# EAGLE design Tauchlampe (EAGLE 6.5.0)
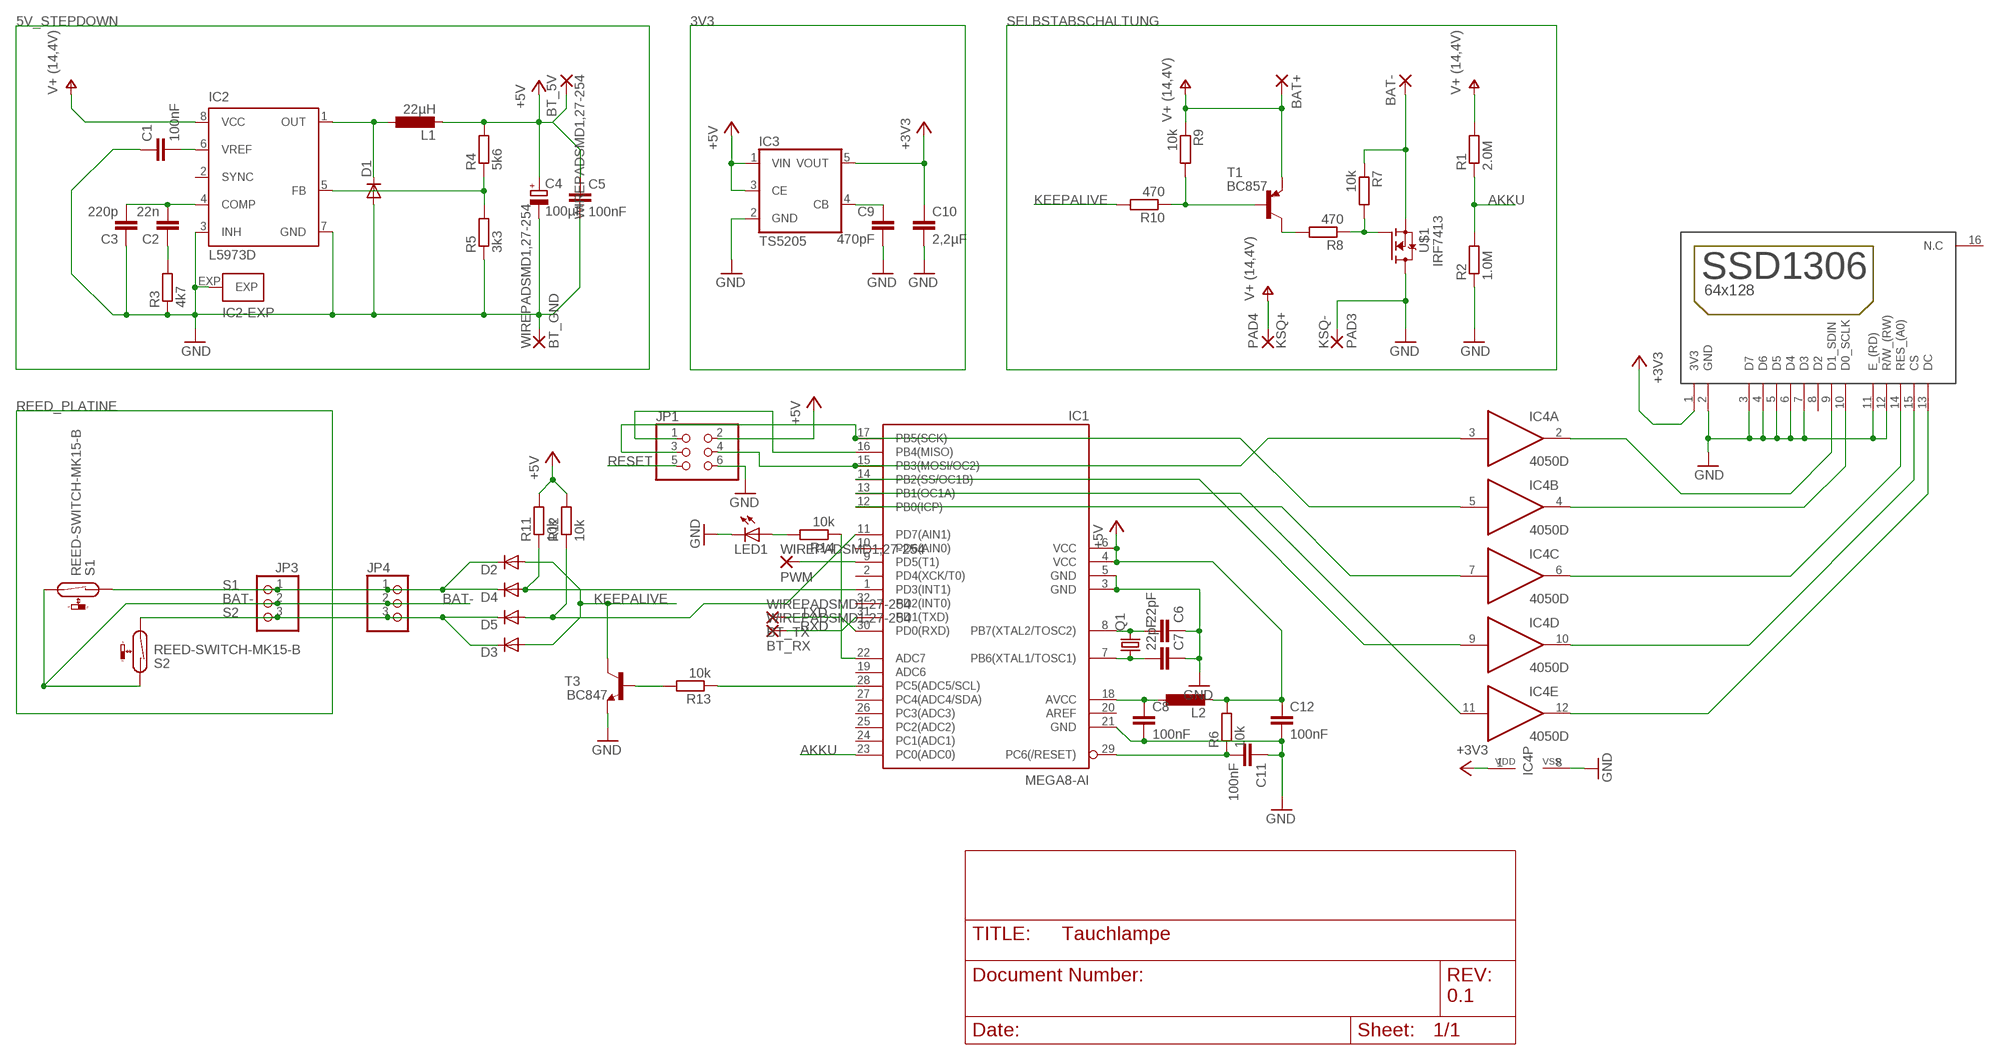
[diagram p0: schematic, sheet 1]

## Parts
BAT+  WIREPAD3,81/1,1  [3,81/1,1]
BAT-  WIREPAD3,81/1,1  [3,81/1,1]
BT_5V  WIREPADSMD1,27-254  [SMD1,27-2,54]
BT_GND  WIREPADSMD1,27-254  [SMD1,27-2,54]
BT_RX  WIREPADSMD1,27-254  [SMD1,27-2,54]
BT_TX  WIREPADSMD1,27-254  [SMD1,27-2,54]
C1  100nF  C-EUC0603K  [C0603K]
C2  22n  C-EUC0603K  [C0603K]
C3  220p  C-EUC0603K  [C0603K]
C4  100µF  CPOL-EU153CLV-0505  [153CLV-0505]
C5  100nF  C-EUC1206  [C1206]
C6  22pF  C-EUC1206  [C1206]
C7  22pF  C-EUC1206  [C1206]
C8  100nF  C-EUC0603K  [C0603K]
C9  470pF  C-EUC0603  [C0603]
C10  2,2µF  C-EUC0603  [C0603]
C11  100nF  C-EUC0603K  [C0603K]
C12  100nF  C-EUC0603K  [C0603K]
D1  DIODE-SMB  [SMB]
D2  DIODE-SOD323-W  [SOD323-W]
D3  DIODE-SOD323-W  [SOD323-W]
D4  DIODE-SOD323-W  [SOD323-W]
D5  DIODE-SOD323-W  [SOD323-W]
IC1  MEGA8-AI  [TQFP32-08]
IC2  L5973D  [HSOP8]
IC3  TS5205  [SOT25]
IC4  4050D  [SO16]
JP1  PINHD-2X3  [2X03]
JP3  PINHD-1X03_2.54  [1X03]
JP4  PINHD-1X03_2.54  [1X03]
L1  22µH  L-EUPISG  [PISG]
L2  L-EUL2012C  [L2012C]
LED1  LEDCHIP-LED0805  [CHIP-LED0805]
PAD3  KSQ-  WIREPAD3,81/1,1  [3,81/1,1]
PAD4  KSQ+  WIREPAD3,81/1,1  [3,81/1,1]
PWM  WIREPADSMD1,27-254  [SMD1,27-2,54]
Q1  CRYSTALHC49UP  [HC49UP]
R1  2.0M  R-EU_M1206  [M1206]
R2  1.0M  R-EU_M1206  [M1206]
R3  4k7  R-EU_R0603  [R0603]
R4  5k6  R-EU_R0603  [R0603]
R5  3k3  R-EU_R0603  [R0603]
R6  10k  R-EU_R1206  [R1206]
R7  10k  R-EU_M0805  [M0805]
R8  470  R-EU_M0805  [M0805]
R9  10k  R-EU_M0805  [M0805]
R10  470  R-EU_M0805  [M0805]
R11  10k  R-EU_M1206  [M1206]
R12  10k  R-EU_M1206  [M1206]
R13  10k  R-EU_M1206  [M1206]
R14  10k  R-EU_M0805  [M0805]
S1  REED-SWITCH-MK15-B  [MK15]
S2  REED-SWITCH-MK15-B  [MK15]
T1  BC857  BC857A-PNP-SOT23-BEC  [SOT23-BEC]
T3  BC847  [SOT23]
U$1  IRF7413  [SO-8]
U$2  SDD1306  [2X08]

## Nets
+3V3: C10.1 IC3.5(VOUT) IC4.1(P:VDD) U$2.1(3V3)
+5V: BT_5V.1(P) C4.+ C5.1 C12.1 IC1.4(VCC) IC1.6(VCC) IC3.1(VIN) IC3.3(CE) JP1.2 L1.2 L2.2 R4.2 R6.2 R11.2 R12.2
AKKU: IC1.23(PC0(ADC0)) R1.1 R2.2
BAT-: BAT-.1(P) JP3.2 JP4.2 R7.1 S1.2 S2.1 U$1.1(S) U$1.2(S) U$1.3(S)
CS_5V: IC1.14(PB2(SS/OC1B)) IC4.9(D:I)
D0_SCLK_5V: IC1.17(PB5(SCK)) IC4.5(B:I) JP1.3
D1_SDIN_5V: IC1.15(PB3(MOSI/OC2)) IC4.3(A:I) JP1.4
DC_5V: IC1.13(PB1(OC1A)) IC4.11(E:I)
GND: BT_GND.1(P) C1.1 C3.1 C4.- C5.2 C6.1 C7.1 C8.2 C9.2 C10.2 C11.1 C12.2 D1.A IC1.3(GND) IC1.5(GND) IC1.21(GND) IC2.3(INH) IC2.7(GND) IC2.EXP IC3.2(GND) IC4.8(P:VSS) JP1.6 LED1.C PAD3.1(P) R2.1 R3.1 R5.1 T3.2(E) U$1.5(D) U$1.6(D) U$1.7(D) U$1.8(D) U$2.2(GND) U$2.3(D7) U$2.4(D6) U$2.5(D5) U$2.6(D4) U$2.7(D3) U$2.11(E_(RD)) U$2.12(R/W_(RW))
KEEPALIVE: D2.A D3.A R10.2 T3.3(C)
N$1: C1.2 IC2.6(VREF)
N$2: D4.A IC1.1(PD3(INT1)) R11.1
N$3: C2.2 C3.2 IC2.4(COMP)
N$4: C2.1 R3.2
N$5: D1.C IC2.1(OUT) L1.1
N$6: C6.2 IC1.8(PB7(XTAL2/TOSC2)) Q1.2
N$7: IC2.5(FB) R4.1 R5.2
N$8: C7.2 IC1.7(PB6(XTAL1/TOSC1)) Q1.1
N$9: R7.2 R8.1 U$1.4(G)
N$10: R9.2 R10.1 T1.B
N$11: R8.2 T1.C
N$12: D5.A IC1.11(PD7(AIN1)) R12.1
N$13: R13.2 T3.1(B)
N$16: IC1.16(PB4(MISO)) JP1.1
N$18: IC1.28(PC5(ADC5/SCL)) R13.1
N$19: C9.1 IC3.4(CB)
N$21: C8.1 IC1.18(AVCC) L2.1
N$22: IC4.2(A:O) U$2.9(D1_SDIN)
N$23: IC4.4(B:O) U$2.10(D0_SCLK)
N$24: IC4.6(C:O) U$2.14(RES_(A0))
N$25: IC4.10(D:O) U$2.15(CS)
N$26: IC4.12(E:O) U$2.13(DC)
N$27: IC1.9(PD5(T1)) PWM.1(P)
N$33: LED1.A R14.2
N$34: IC1.22(ADC7) R14.1
RES_5V: IC1.12(PB0(ICP)) IC4.7(C:I)
RESET: C11.2 IC1.29(PC6(/RESET)) JP1.5 R6.1
RXD: BT_RX.1(P) IC1.31(PD1(TXD))
S1: D2.C D4.C JP3.1 JP4.1 S1.1
S2: D3.C D5.C JP3.3 JP4.3 S2.2
TXD: BT_TX.1(P) IC1.30(PD0(RXD))
V+: BAT+.1(P) IC2.8(VCC) PAD4.1(P) R1.2 R9.1 T1.E ; supply symbol labelled V+ (14,4V)
Unconnected: IC1.2(PD4(XCK/T0)) IC1.10(PD6(AIN0)) IC1.19(ADC6) IC1.20(AREF) IC1.24(PC1(ADC1)) IC1.25(PC2(ADC2)) IC1.26(PC3(ADC3)) IC1.27(PC4(ADC4/SDA)) IC1.32(PD2(INT0)) IC2.2(SYNC) IC4.14(F:I) IC4.15(F:O) U$2.8(D2) U$2.16(N.C)

## Notes on the sheet
- 0.1

## Library data of the parts
BAT+ BAT- BT_5V BT_GND BT_RX BT_TX PAD3 PAD4 PWM = wirepad:WIREPAD: Wire PAD connect wire on PCB
C1-C3 C5-C12 = rcl:C-EU: CAPACITOR, European symbol
C4 = rcl:CPOL-EU: POLARIZED CAPACITOR, European symbol
D1-D5 = diode:DIODE-: DIODE
IC1 = atmel:MEGA8: MICROCONTROLLER 8 Kbytes FLASH, 1 kbytes SRAM, 512 bytes EEPROM, USART, 6-channel 10 bit ADC, 2-channel 8 bit ADC Pin compatible with Atmega48, ATMega88, ATMega168 Source: avr.lbr; MPN: ATMEGA8-16AU; OC_FARNELL: 9171371; OC_NEWARK: 73M8863
IC2 = st-microelectronics:L5973D: 2.5 A switch step down switching regulator Source: Data sheet <http://www.st.com/internet/com/TECHNICAL_RESOURCES/TECHNICAL_LITERATURE/DATASHEET/CD00002851.pdf>; MF: STMICROELECTRONICS; MPN: L5973D; OC_FARNELL: 1077145
IC3 = v-reg:TS5205: 150mA Low Noise LDO Voltage Regulator with Enable TSC [Taiwan Semiconductor Company, Ltd] Source: http://www.taiwansemi.com .. 5205_0409c.pdf
IC4 = 40xx:4050: Hex non-inverting BUFFER
JP1 = pinhead:PINHD-2X3: PIN HEADER
JP3 JP4 = pinhead-2:PINHD-1X03: PIN HEADER
L1 = inductor-fastron:L-EU
L2 = rcl:L-EU: INDUCTOR, European symbol
LED1 = led:LED: LED OSRAM: - CHIPLED LG R971, LG N971, LY N971, LG Q971, LY Q971, LO R971, LY R971 LH N974, LH R974 LS Q976, LO Q976, LY Q976 LO Q996 - Hyper CHIPLED LW Q18S LB Q993, LB Q99A, LB R99A - SideLED LS A670, LO A670, LY A670, LG A670, LP A670 LB A673, LV A673, LT A673, LW A673 LH A674 LY A675 LS A676, LA A676, LO A676, LY A676, LW A676 LS A679, LY A679, LG A679 - Hyper Micro SIDELED® LS Y876, LA Y876, LO Y876, LY Y876 LT Y87S - SmartLED LW L88C, LW L88S LB L89C, LB L89S, LG L890 LS L89K, LO L89K, LY L89K LS L896, LA L896, LO L896, LY L896 - TOPLED LS T670, LO T670, LY T670, LG T670, LP T670 LSG T670, LSP T670, LSY T670, LOP T670, LYG T670 LG T671, LOG T671, LSG T671 LB T673, LV T673, LT T673, LW T673 LH T674 LS T676, LA T676, LO T676, LY T676, LB T676, LH T676, LSB T676, LW T676 LB T67C, LV T67C, LT T67C, LS T67K, LO T67K, LY T67K, LW E67C LS E67B, LA E67B, LO E67B, LY E67B, LB E67C, LV E67C, LT E67C LW T67C LS T679, LY T679, LG T679 LS T770, LO T770, LY T770, LG T770, LP T770 LB T773, LV T773, LT T773, LW T773 LH T774 LS E675, LA E675, LY E675, LS T675 LS T776, LA T776, LO T776, LY T776, LB T776 LHGB T686 LT T68C, LB T68C - Hyper Mini TOPLED® LB M676 - Mini TOPLED Santana® LG M470 LS M47K, LO M47K, LY M47K Source: http://www.osram.convergy.de LUXEON: - LUMILED® LXK2-PW12-R00, LXK2-PW12-S00, LXK2-PW14-U00, LXK2-PW14-V00 LXK2-PM12-R00, LXK2-PM12-S00, LXK2-PM14-U00 LXK2-PE12-Q00, LXK2-PE12-R00, LXK2-PE12-S00, LXK2-PE14-T00, LXK2-PE14-U00 LXK2-PB12-K00, LXK2-PB12-L00, LXK2-PB12-M00, LXK2-PB14-N00, LXK2-PB14-P00, LXK2-PB14-Q00 LXK2-PR12-L00, LXK2-PR12-M00, LXK2-PR14-Q00, LXK2-PR14-R00 LXK2-PD12-Q00, LXK2-PD12-R00, LXK2-PD12-S00 LXK2-PH12-R00, LXK2-PH12-S00 LXK2-PL12-P00, LXK2-PL12-Q00, LXK2-PL12-R00 Source: www.luxeon.com KINGBRIGHT: KA-3528ASYC Source: www.kingbright.com
Q1 = crystal:CRYSTAL: CRYSTAL; OC_FARNELL: unknown; OC_NEWARK: unknown
R1-R14 = rcl:R-EU_: RESISTOR, European symbol
S1 S2 = switch-reed:REED-SWITCH-: Reed Sensor; MF: MEDER; MPN: MK15-B-2; OC_FARNELL: 1079484
T1 = transistor:*-PNP-: PNP Transistror
T3 = transistor:BC847: NPN TRANSISTOR
U$1 = 01_eigeneBauteile:IRF7413
U$2 = Display-SSD1306:SDD1306

## Net classes
0 default: width 0.406 mm

## Board
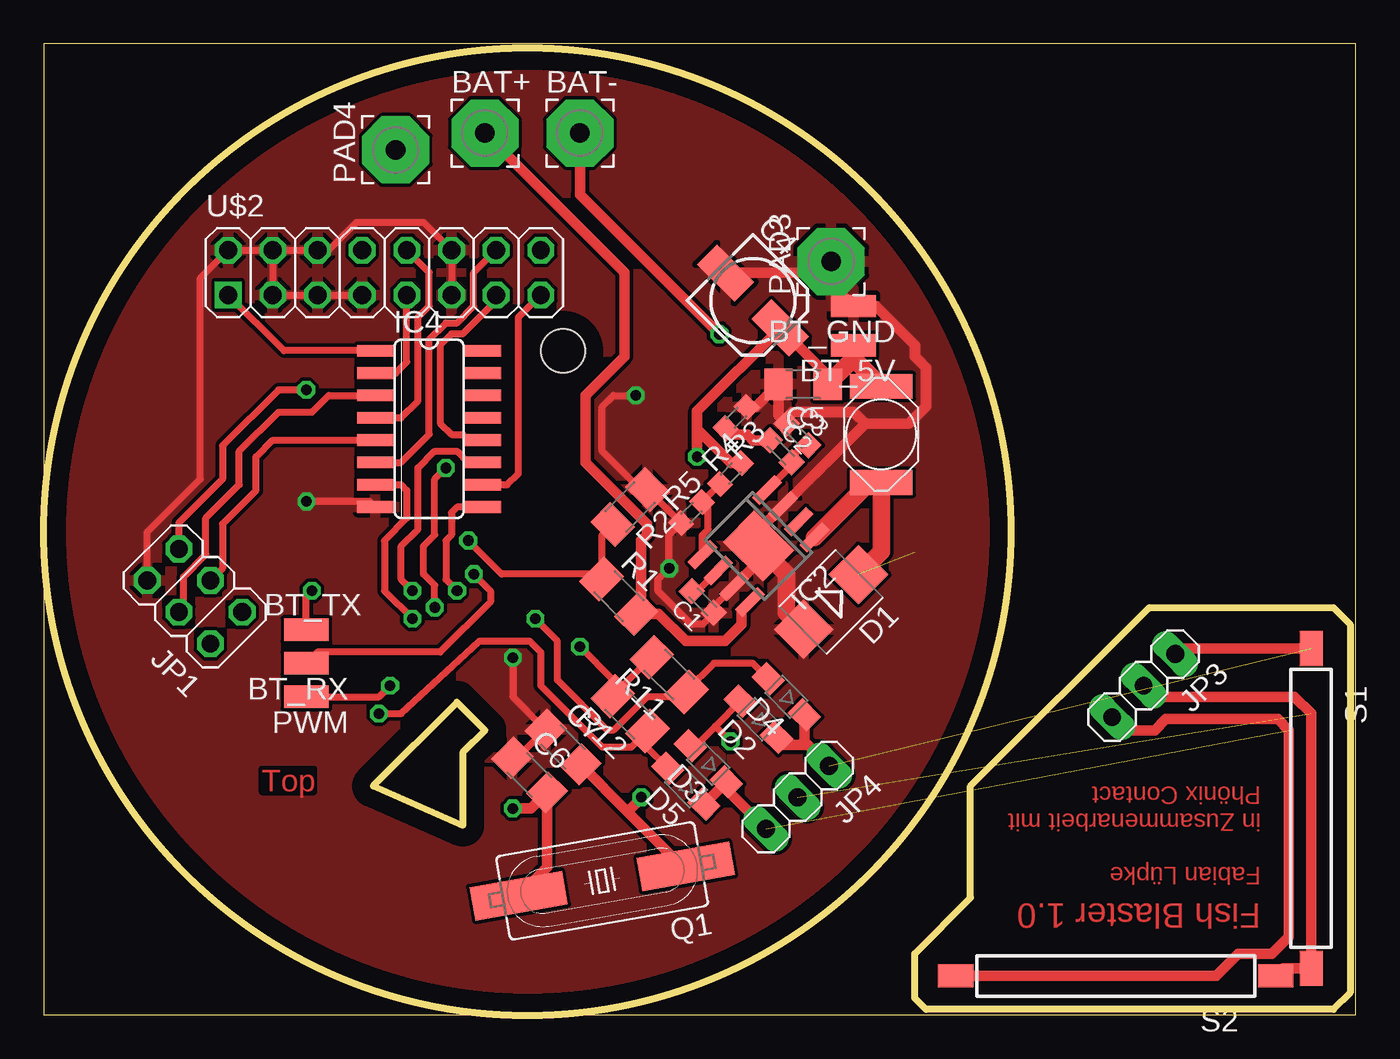
[diagram p1: board, top side]
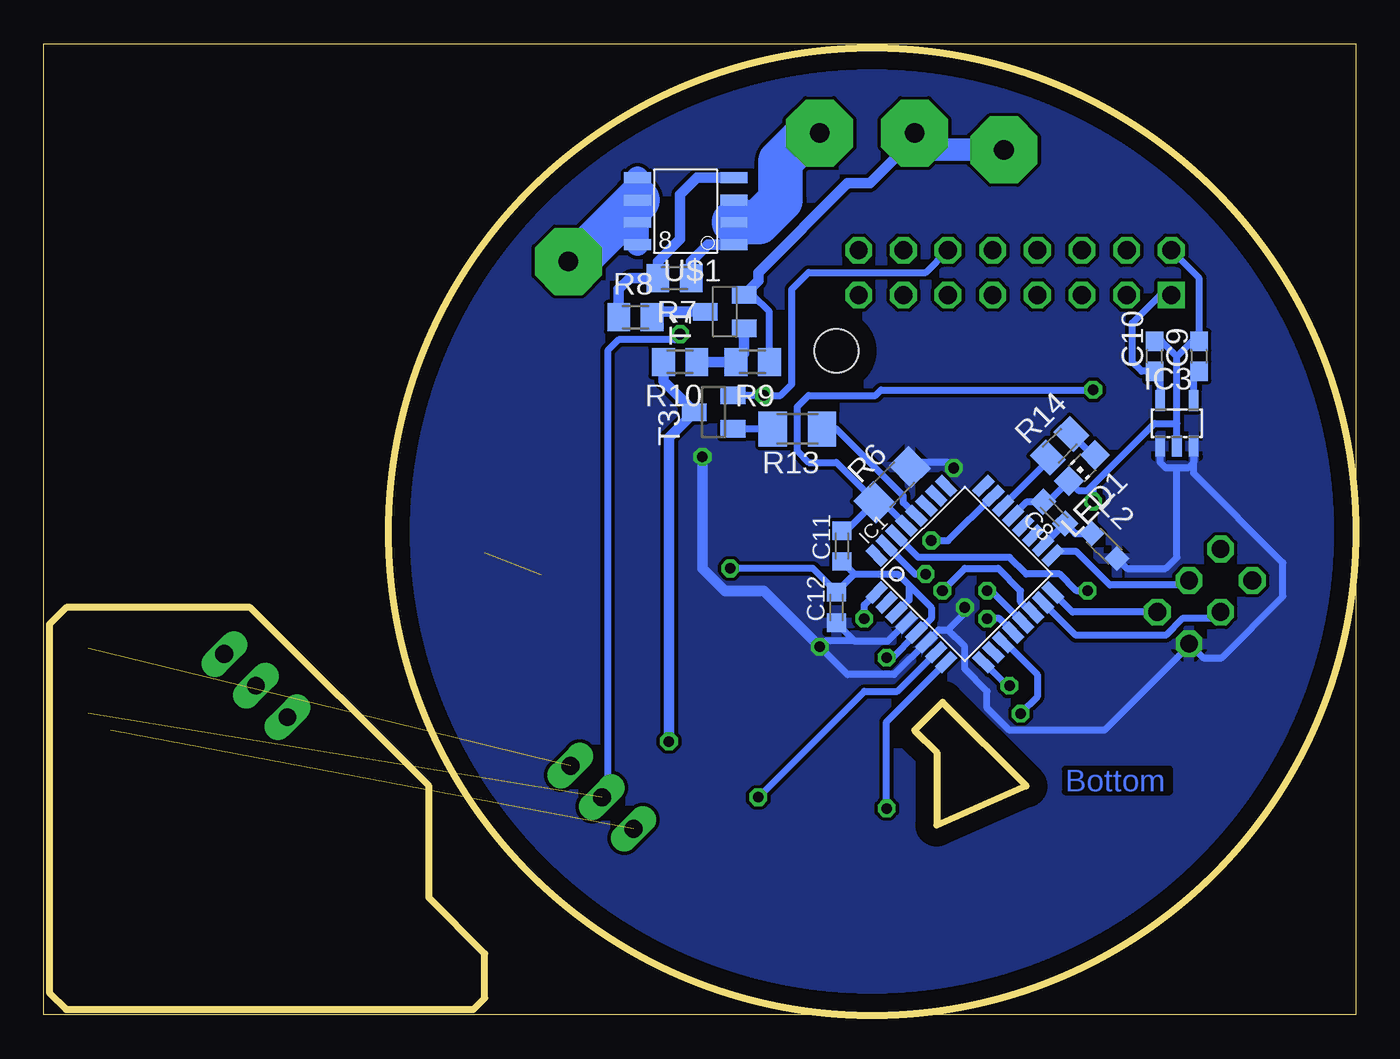
[diagram p2: board, bottom side, seen from below]

Size 74.6 x 55.23 mm. Coordinates in mm from the lower left corner, seen from the top.
Outline: 0,0 74.6,0 74.6,55.23 0,55.23 0,0
Outline: 23.5,17.78 25.08,16.19 23.81,14.92 23.81,10.79 18.73,13.02 23.5,17.78
Outline: 73.34,0.32 50.16,0.32 49.53,0.95 49.53,3.49 52.7,6.67 52.7,13.02 62.87,23.18 73.34,23.18 74.3,22.23 74.3,1.27 73.34,0.32
Outline: circle at 27.5,27.5 radius 27.5
Copper layers (1*16): Top 0.035mm / dielectric 1.5mm / Bottom 0.035mm
Design rules "default": minimum track width 10mil, minimum drill 24mil, track to track 8mil, track to pad 8mil, pad to pad 8mil, via to via 8mil, smd to smd 8mil, copper to edge 40mil, drill to drill 8mil, minimum pad ring 10mil, minimum via ring 8mil, stop-mask expansion 4mil, vias tented up to drill 0mil, thermal gap 10mil
Holes 2.5 mm at 29.53,37.78

### Footprints (pad centres in the part's own frame; a part is rotated, then mirrored left to right if it is on the bottom)
3,81/1,1 = drill 1.118 pad 3.81 octagon: 1 0,0
SMD1,27-2,54 = smd 1.27 x 2.54: 1 0,0
C0603K = smd 1.05 x 1.08: 1 -0.875,0; 2 0.875,0
153CLV-0505 = smd 3 x 1.6: + 2.2,0; - -2.2,0
C1206 = smd 1.6 x 1.8: 1 -1.4,0; 2 1.4,0
C0603 = smd 1.1 x 1: 1 -0.85,0; 2 0.85,0
SMB = smd 2.4 x 2.4: A 2.2,0; C -2.2,0
SOD323-W = smd 1.5 x 1.2: A 1.45,0; C -1.45,0
TQFP32-08 = smd 1.27 x 0.559: 1 -4.293,2.8; 2 -4.293,2; 3 -4.293,1.2; 4 -4.293,0.4; 5 -4.293,-0.4; 6 -4.293,-1.2; 7 -4.293,-2; 8 -4.293,-2.8; 17 4.293,-2.8; 18 4.293,-2; 19 4.293,-1.2; 20 4.293,-0.4; 21 4.293,0.4; 22 4.293,1.2; 23 4.293,2; 24 4.293,2.8 | smd 0.559 x 1.27: 9 -2.8,-4.293; 10 -2,-4.293; 11 -1.2,-4.293; 12 -0.4,-4.293; 13 0.4,-4.293; 14 1.2,-4.293; 15 2,-4.293; 16 2.8,-4.293; 25 2.8,4.293; 26 2,4.293; 27 1.2,4.293; 28 0.4,4.293; 29 -0.4,4.293; 30 -1.2,4.293; 31 -2,4.293; 32 -2.8,4.293
HSOP8 = smd 0.6 x 1.8: 1 -1.905,-2.6; 2 -0.635,-2.6; 3 0.635,-2.6; 4 1.905,-2.6; 5 1.905,2.6; 6 0.635,2.6; 7 -0.635,2.6; 8 -1.905,2.6 | smd 3.2 x 2.51: EXP 0,0
SOT25 = smd 0.55 x 1.2: 1 -0.95,-1.3; 2 0,-1.3; 3 0.95,-1.3; 4 0.95,1.3; 5 -0.95,1.3
SO16 = smd 0.66 x 2.032: 1 -4.445,-3.073; 2 -3.175,-3.073; 3 -1.905,-3.073; 4 -0.635,-3.073; 5 0.635,-3.073; 6 1.905,-3.073; 7 3.175,-3.073; 8 4.445,-3.073; 9 4.445,3.073; 10 3.175,3.073; 11 1.905,3.073; 12 0.635,3.073; 13 -0.635,3.073; 14 -1.905,3.073; 15 -3.175,3.073; 16 -4.445,3.073
2X03 = drill 1.016 octagon: 1 -2.54,-1.27; 2 -2.54,1.27; 3 0,-1.27; 4 0,1.27; 5 2.54,-1.27; 6 2.54,1.27
1X03 = drill 1.016 long: 1 -2.54,0; 2 0,0; 3 2.54,0
PISG = smd 1.4 x 3.56: 1 -2.73,0; 2 2.73,0
L2012C = smd 1 x 1: 1 -1,0; 2 1,0
CHIP-LED0805 = smd 1.2 x 1.2: A 0,-1.05; C 0,1.05
HC49UP = smd 5.334 x 1.93: 1 -4.826,0; 2 4.826,0
M1206 = smd 1.6 x 2: 1 -1.4,0; 2 1.4,0
R0603 = smd 1 x 1.1: 1 -0.85,0; 2 0.85,0
R1206 = smd 1.6 x 1.803: 1 -1.422,0; 2 1.422,0
M0805 = smd 1.3 x 1.6: 1 -0.95,0; 2 0.95,0
MK15 = smd 2 x 1.3: 1 -9.1,0; 2 9.1,0
SOT23-BEC = smd 1 x 1.4: B -0.95,-1.1; C 0,1.1; E 0.95,-1.1
SOT23 = smd 1 x 1.4: 1 -0.95,-1.1; 2 0.95,-1.1; 3 0,1.1
SO-8 = smd 1.524 x 0.61: 1 -2.743,1.905; 2 -2.743,0.635; 3 -2.743,-0.635; 4 -2.743,-1.905; 5 2.743,-1.905; 6 2.743,-0.635; 7 2.743,0.635; 8 2.743,1.905
2X08 = drill 1.016 square: 1 -8.89,-1.27 | drill 1.016 octagon: 2 -8.89,1.27; 3 -6.35,-1.27; 4 -6.35,1.27; 5 -3.81,-1.27; 6 -3.81,1.27; 7 -1.27,-1.27; 8 -1.27,1.27; 9 1.27,-1.27; 10 1.27,1.27; 11 3.81,-1.27; 12 3.81,1.27; 13 6.35,-1.27; 14 6.35,1.27; 15 8.89,-1.27; 16 8.89,1.27

### Placement (x,y rotation side)
BAT+  25.08,50.16 0 top
BAT-  30.48,50.16 0 top
BT_5V  46.04,38.1 90 top
BT_GND  46.04,40.32 90 top
BT_RX  14.92,20 90 top
BT_TX  14.92,21.91 270 top
C1  37.47,23.5 135 top
C2  41.91,32.07 315 top
C3  42.86,33.02 315 top
C4  40.32,40.64 315 top
C5  43.18,35.88 180 top
C6  27.62,13.65 315 top
C7  29.53,15.24 315 top
C8  17.14,28.57 135 bottom
C9  8.89,37.47 90 bottom
C10  11.43,37.47 90 bottom
C11  29.21,26.67 90 bottom
C12  29.53,23.18 90 bottom
D1  44.77,23.5 225 top
D2  40.64,16.83 135 top
D3  37.78,14.29 135 top
D4  42.23,18.1 135 top
D5  36.51,13.02 135 top
IC1  22.23,25.08 45 bottom
IC2  40.64,26.67 135 top
IC3  10.16,33.66 0 bottom
IC4  21.91,33.34 270 top
JP1  8.57,23.81 135 top
JP3  62.55,18.73 225 top
JP4  42.86,12.38 225 top
L1  47.62,33.02 90 top
L2  14.29,26.67 315 bottom
LED1  15.56,31.11 135 bottom
PAD3  44.77,42.86 90 top
PAD4  20,49.21 90 top
PWM  14.92,18.1 90 top
Q1  31.75,7.62 190 top
R1  32.7,23.81 315 top
R2  33.34,28.89 225 top
R3  39.37,33.97 225 top
R4  39.05,30.8 45 top
R5  36.83,28.57 45 top
R6  26.35,30.16 45 bottom
R7  38.73,41.91 180 bottom
R8  40.96,39.69 0 bottom
R9  34.29,37.15 180 bottom
R10  38.42,37.15 180 bottom
R11  35.56,19.37 135 top
R12  33.34,17.14 135 top
R13  31.75,33.34 180 bottom
R14  16.83,32.38 45 bottom
S1  72.07,11.75 270 top
S2  60.96,2.22 180 top
T1  35.88,40.01 90 bottom
T3  36.51,34.29 90 bottom
U$1  38.1,45.72 180 bottom
U$2  19.37,42.23 0 top

### Tracks (layer width: path | path; a pad name or v marks a point on that pad's centre or on a via)
+3V3
  Top 0.406: IC4.1 13.65,37.78 U$2.1
  Bottom 0.406: IC3.5 11.11,36.62 C10.1 12.17,36.62 12.7,37.15 12.7,39.37 11.11,40.96 U$2.1
+5V  (via drill 0.6 pad 0.61, 0.61)
  Top 0.406: R11.2 R12.2 32.35,19.09 v30.48,20.95 | 46.04,37.34 BT_5V.1 | C5.1 44.58,36.38 | R4.2 39.09,31.4 | v22.86,31.11 22.23,30.48 22.23,27.3 21.59,26.67 21.59,25.08 22.23,24.45 v22.23,23.18
  Top 0.61: 44.58,36.38 C4.+ 37.15,34.35 37.15,33.34 | 39.09,31.4 37.15,33.34 | v37.15,31.75 37.15,33.34
  Top 1: C5.1 46.04,37.34 | L1.2 46.04,37.34 BT_5V.1
  Bottom 0.406: C12.1 28.5,21.27 | 28.5,21.27 26.6,21.27 IC1.4 | 28.5,21.27 30.16,21.27 v30.48,20.95 28.89,19.37 26.24,19.37 IC1.6 23.7,21.91 23.18,21.91 | 10.16,31.11 9.53,31.11 9.21,31.43 IC3.3 9.21,30.8 4.13,25.72 4.13,23.81 7.62,20.32 8.67,20.32 JP1.2 9.53,20.95 14.29,16.19 19.68,16.19 20.95,17.46 20.95,18.41 22.23,19.68 22.23,20.95 23.18,21.91 | 10.16,31.11 10.79,31.11 11.11,31.43 IC3.1 | L2.2 13.02,25.4 10.79,25.4 10.16,26.04 10.16,31.11 | v22.86,31.11 23.18,31.43 24.77,31.43 25.08,31.11 R6.2 | 23.18,21.91 22.23,22.86 v22.23,23.18
  Bottom 0.61: v30.48,20.95 33.66,24.13 35.88,24.13 37.15,25.4 v37.15,31.75
  pour Bottom: -1.91,-1.59 57.47,-1.59 57.47,57.15 -0.95,57.15 -2.22,57.15 -2.22,-1.59
AKKU  (via drill 0.61)
  Top 0.406: v24.13,26.99 26.04,25.08 31.43,25.08 R1.1 31.75,25.08 31.75,27.3 R2.2
  Bottom 0.406: v24.13,26.99 23.18,26.99 20.64,29.53 IC1.23
BAT-  (via drill 0.61)  (1 unrouted)
  Top 0.406: S2.1 70.48,2.65
  Top 0.61: 70.48,2.65 S1.2 72.07,17.14 71.12,18.1 63.18,18.1 JP3.2 | v38.42,38.73 30.48,46.67 BAT-.1
  Bottom 0.406: 42.55,12.7 42.55,37.78 41.91,38.42 38.73,38.42 v38.42,38.73
  Bottom 0.61: R7.1 37.78,42.86 36.83,43.81 U$1.1 U$1.2 U$1.3 | 42.55,12.7 JP4.2
  Bottom 2.54: U$1.2 33.97,45.09 32.7,46.35 32.7,48.58 31.11,50.16 BAT-.1
CS_5V  (via drill 0.61)
  Top 0.406: v23.5,24.13 22.86,24.77 22.86,26.99 23.18,27.3 23.18,28.57 23.5,28.89 IC4.9
  Bottom 0.406: v23.5,24.13 22.23,25.4 20.32,25.4 19.05,24.13 19.05,23.5 18.45,22.9 IC1.14
D0_SCLK_5V
  Top 0.406: IC4.5 13.02,32.7 12.06,31.75 12.06,29.84 10.16,27.94 10.16,25.4 JP1.3
  Bottom 0.406: JP1.3 9.73,24.45 13.97,24.45 15.88,26.35 17,26.35 IC1.17
D1_SDIN_5V
  Top 0.406: JP1.4 7.94,23.18 7.94,24.92 9.21,26.19 9.21,28.26 11.11,30.16 11.11,32.07 13.34,34.29 15.24,34.29 16.19,35.24 IC4.3
  Bottom 0.406: JP1.4 8.05,22.54 9.84,22.54 10.79,21.59 15.9,21.59 IC1.15
DC_5V  (via drill 0.6)
  Top 0.406: v20.95,24.13 20.32,24.77 20.32,26.67 21.27,27.62 21.27,31.11 22.23,32.07 23.5,32.07 24.13,31.43 IC4.11
  Bottom 0.406: IC1.13 20.71,24.13 v20.95,24.13
GND  (via drill 0.6, 0.6 pad 0.61, 0.61)
  Top 0.406: 40.64,27.57 IC2.EXP | IC2.7 38.08,23.22 C1.1 38.08,22.84 37.47,22.23 36.83,22.23 34.92,24.13 34.92,24.77 v35.56,25.4 35.56,27.3 R5.1 R2.1 33.94,29.88 31.75,32.07 31.75,34.61 32.38,35.24 v33.66,35.24 | R3.1 40.48,34.57 | U$2.4 U$2.2 8.89,41.91 8.89,30.48 5.88,27.47 JP1.6 | U$2.4 U$2.6 16.19,43.5 17.78,45.09 21.59,45.09 U$2.12 U$2.11 | U$2.4 U$2.3 U$2.5 U$2.7 | C6.1 26.95,14.64 C7.1 | 28.26,16.51 26.67,18.1 v26.67,20.32 | IC4.8 18.52,29.21 v14.92,29.21
  Top 0.61: 46.71,33.64 IC2.3 40.64,27.57 | 44.77,42.23 44.77,41.59 BT_GND.1 47.31,40.32 49.53,38.1 49.53,37.47 50.16,36.83 50.16,34.61 49.2,33.64 46.71,33.64 | 44.77,42.23 PAD3.1 | 46.71,33.64 46.04,34.29 42.55,34.29 C3.1 41.78,34.1 C5.2 40.48,34.57 | 44.77,42.23 39.05,42.23 C4.- | 28.26,16.51 C7.1 | IC2.EXP 40.64,25.77 IC2.7
  Top 1: IC2.EXP 42.23,25.08 42.23,22.86 43.15,21.94
  Top 1.27: 43.15,21.94 D1.A
  Bottom 0.406: v35.56,25.4 30.88,25.4 C12.2 28.5,25.08 | IC1.21 18.68,29.19 C8.2 17.48,29.19 LED1.C 15.77,29.84 15.24,29.84 14.92,30.16 | T3.2 v33.66,35.24 32.7,35.24 32.07,35.88 32.07,41.27 31.11,42.23 24.45,42.23 U$2.12 | C11.1 28.5,25.08 | 28.5,25.08 26.04,25.08 25.4,24.45 | 25.4,24.45 25.4,23.61 IC1.3 | 25.4,24.45 24.13,23.18 24.13,22.54 24.91,21.76 IC1.5 25.08,21.59 26.35,20.32 v26.67,20.32 | IC3.2 10.16,33.66 | 10.16,33.66 10.16,37.47 | 10.16,37.47 9.31,38.31 C9.2 8.89,41.91 U$2.2 | 10.16,37.47 11.01,38.31 C10.2 | 14.92,30.16 11.43,33.66 10.16,33.66 | v14.92,29.21 14.92,30.16
  Bottom 1.27: U$1.5 U$1.6 U$1.7 U$1.8 | 44.34,42.86 PAD3.1
  Bottom 2.54: U$1.6 44.34,42.86
  pour Top: 0,0 51.12,0 54.29,0 55.88,0 55.88,49.85 55.88,55.24 0,55.24
KEEPALIVE  (via drill 0.6 pad 0.61)
  Top 0.406: D2.A 38.19,16.42 | 38.19,16.42 37.08,15.31 D3.A | v39.05,15.56 38.19,16.42 | 38.19,16.42
  Bottom 0.61: R10.2 39.37,36.05 T3.3 39.05,32.85 v39.05,15.56
N$1
  Top 0.406: IC2.6 37.19,24.11 C1.2
N$2  (via drill 0.6 pad 0.61)
  Top 0.406: D4.A 40.32,20 38.1,20 36.55,18.45 | 36.55,18.45 R11.1 | 36.55,18.45 36.2,18.1 34.29,18.1 32.38,16.19 32.07,16.19 29.21,19.05 29.21,21.27 v27.94,22.54
  Bottom 0.406: v27.94,22.54 27.94,23.33 IC1.1
N$3
  Top 0.406: IC2.4 42.41,31.13 42.55,31.11 42.55,31.43 C2.2 42.55,31.75 43.18,32.38 C3.2
N$4
  Top 0.61: R3.2 39.12,33.02 40.01,33.02 40.34,32.69 C2.1
N$5  (1 unrouted)
  Top 0.61: 46.95,30.29 L1.1
  Top 1: L1.1 47.62,26.35 D1.C | IC2.1 46.95,30.29
N$6  (via drill 0.6)
  Top 0.61: Q1.2 28.61,8.4 C6.2 27.7,11.75 v26.67,11.75
  Bottom 0.406: v26.67,11.75 26.67,16.68 IC1.8
N$7
  Top 0.406: R4.1 R5.2 37.78,29.18 37.78,27.62 37.45,27.29 IC2.5
N$8  (via drill 0.6)
  Top 0.406: Q1.1 36.5,8.27 | 33.97,12.33 v33.97,12.38
  Top 0.61: 36.5,8.27 33.2,11.56 | 33.2,11.56 C7.2 | 33.2,11.56 33.97,12.33
  Bottom 0.406: v33.97,12.38 27.94,18.41 26.06,18.41 IC1.7
N$9
  Bottom 0.406: R7.2 | R8.1
  Bottom 0.61: U$1.4 37.47,47.62 38.42,46.67 38.42,44.13 39.69,42.86 R7.2 | R7.2 41.27,41.91 41.91,41.27 R8.1
N$10
  Bottom 0.61: T1.B 34.78,37.61 R9.2 R10.1
N$11
  Bottom 0.61: R8.2 39.52,40.01 T1.C
N$12  (via drill 0.6)
  Top 0.406: D5.A 34.33,15.2 R12.1 33.41,15.24 31.75,15.24 28.26,18.73 28.26,20.64 27.62,21.27 24.77,21.27 20.32,17.14 v19.05,17.14
  Bottom 0.406: IC1.11 19.93,21.2 18.1,19.37 18.1,18.1 v19.05,17.14
N$13
  Bottom 0.406: R13.2 T3.1
N$16
  Bottom 0.406: JP1.1 16.1,22.91 IC1.16
N$18
  Bottom 0.406: IC1.28 25.72,29.14 25.72,29.53 29.53,33.34 R13.1
N$19
  Bottom 0.406: IC3.4 9.21,36.62 C9.1
N$21
  Bottom 0.406: IC1.18 C8.1 15.95,27.38 L2.1
N$22
  Top 0.406: IC4.2 20,36.51 20.64,37.15 U$2.9
N$23
  Top 0.406: IC4.4 20.32,33.97 21.27,34.92 21.27,39.69 21.91,40.32 21.91,42.23 U$2.10
N$24
  Top 0.406: IC4.6 20.32,31.43 21.91,33.02 21.91,38.42 22.86,39.37 23.5,39.37 24.45,40.32 24.45,42.23 U$2.14
N$25
  Top 0.406: IC4.10 26.35,30.16 26.99,30.8 26.99,39.69 U$2.15
N$26
  Top 0.406: U$2.13 25.72,40.64 23.81,38.73 23.18,38.73 22.54,38.1 22.54,33.66 23.18,33.02 23.81,33.02 24.13,32.7 IC4.12
N$27  (via drill 0.6)
  Top 0.406: PWM.1 19.05,18.1 v19.68,18.73
  Bottom 0.406: IC1.9 19.84,18.73 v19.68,18.73
N$33
  Bottom 0.406: LED1.A 14.96,31.86 R14.2
N$34
  Bottom 0.406: IC1.22 17.61,31.4 R14.1
RES_5V  (via drill 0.61)
  Top 0.406: v20.95,22.54 19.37,24.13 19.37,26.99 20.64,28.26 20.64,29.84 20.32,30.16 IC4.7
  Bottom 0.406: IC1.12 20.25,22.54 v20.95,22.54
RESET  (via drill 0.61)
  Top 0.406: v14.92,35.56 13.34,35.56 10.16,32.38 10.16,30.48 7.67,27.99 JP1.5
  Bottom 0.406: IC1.29 26.86,29.16 R6.1 | R6.1 28.97,27.55 C11.2 29.21,27.62 | v14.92,35.56 26.99,35.56 27.3,35.24 31.11,35.24 31.75,34.61 31.75,32.07 31.11,31.43 29.53,31.43 27.36,29.26 R6.1
RXD  (via drill 0.6)
  Top 0.406: v24.45,25.08 25.4,24.13 25.4,23.5 22.54,20.64 15.56,20.64 BT_RX.1
  Bottom 0.406: IC1.31 25.05,25.08 v24.45,25.08
S1  (1 unrouted)
  Top 0.406: D2.C 42.09,15.38 | 64.66,20.85 JP3.1
  Top 0.61: 43.25,15.38 D4.C | 42.09,15.38 43.25,15.38 | S1.1 64.66,20.85 | 43.25,15.38 43.46,15.38 JP4.1
S2  (1 unrouted)
  Top 0.406: 60.85,16.94 JP3.3
  Top 0.61: S2.2 66.67,2.22 67.94,3.49 69.85,3.49 70.8,4.45 70.8,16.19 70.17,16.83 63.82,16.83 63.18,16.19 61.59,16.19 60.85,16.94 | D5.C D3.C 38.81,12.85 JP4.3
TXD  (via drill 0.61)
  Top 0.406: v15.24,24.13 14.92,23.81 BT_TX.1
  Bottom 0.406: v15.24,24.13 15.88,24.13 16.83,25.08 18.73,25.08 19.68,26.04 24.88,26.04 IC1.30
V+
  Top 0.406: IC2.8 40.02,23.48 | R1.2 33.97,23.1
  Top 0.61: R1.2 34.96,22.82 36.51,21.27 38.73,21.27 39.69,22.23 39.69,23.02 IC2.8 | 33.97,23.1 33.97,26.99 34.29,27.3 34.29,27.94 30.8,31.43 30.8,35.24 33.02,37.47 33.02,42.23 BAT+.1
  Bottom 0.406: 25.08,49.85 BAT+.1 | R9.1 33.34,40 33.34,40.01 34.29,40.95 T1.E
  Bottom 0.61: T1.E 33.97,41.76 33.97,42.23 28.89,47.31 27.62,47.31 25.08,49.85
  Bottom 1.27: BAT+.1 24.13,49.21 PAD4.1

### Text on the board
Top: Top | Fabian Lüpke / / in Zusammenarbeit mit / Phönix Contact | Fish Blaster 1.0
Bottom: Bottom